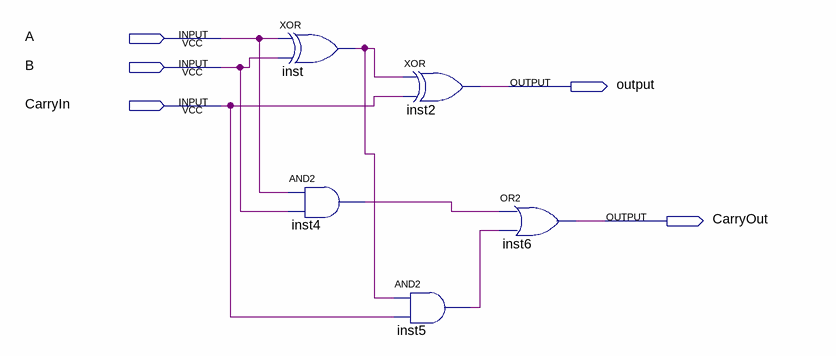
[diagram p0: schematic sheet]
// Quartus schematic CelulaSomador.bdf as structural Verilog: 5 symbols, 5 pins
module CelulaSomador (
  input  A,
  input  B,
  input  CarryIn,
  output \output ,
  output CarryOut
);

  wire inst4_out, inst5_out, inst_out;

  xor inst (inst_out, A, B);
  and inst4 (inst4_out, A, B);
  xor inst2 (\output , inst_out, CarryIn);
  and inst5 (inst5_out, inst_out, CarryIn);
  or inst6 (CarryOut, inst4_out, inst5_out);
endmodule
